# Altium schematic sheet ClockGenerator.SchDoc: Clock Generator
size A2; DrawnBy: Patrik Staudenmayer; DocumentNumber: 11; SheetNumber: 11; SheetTotal: 15
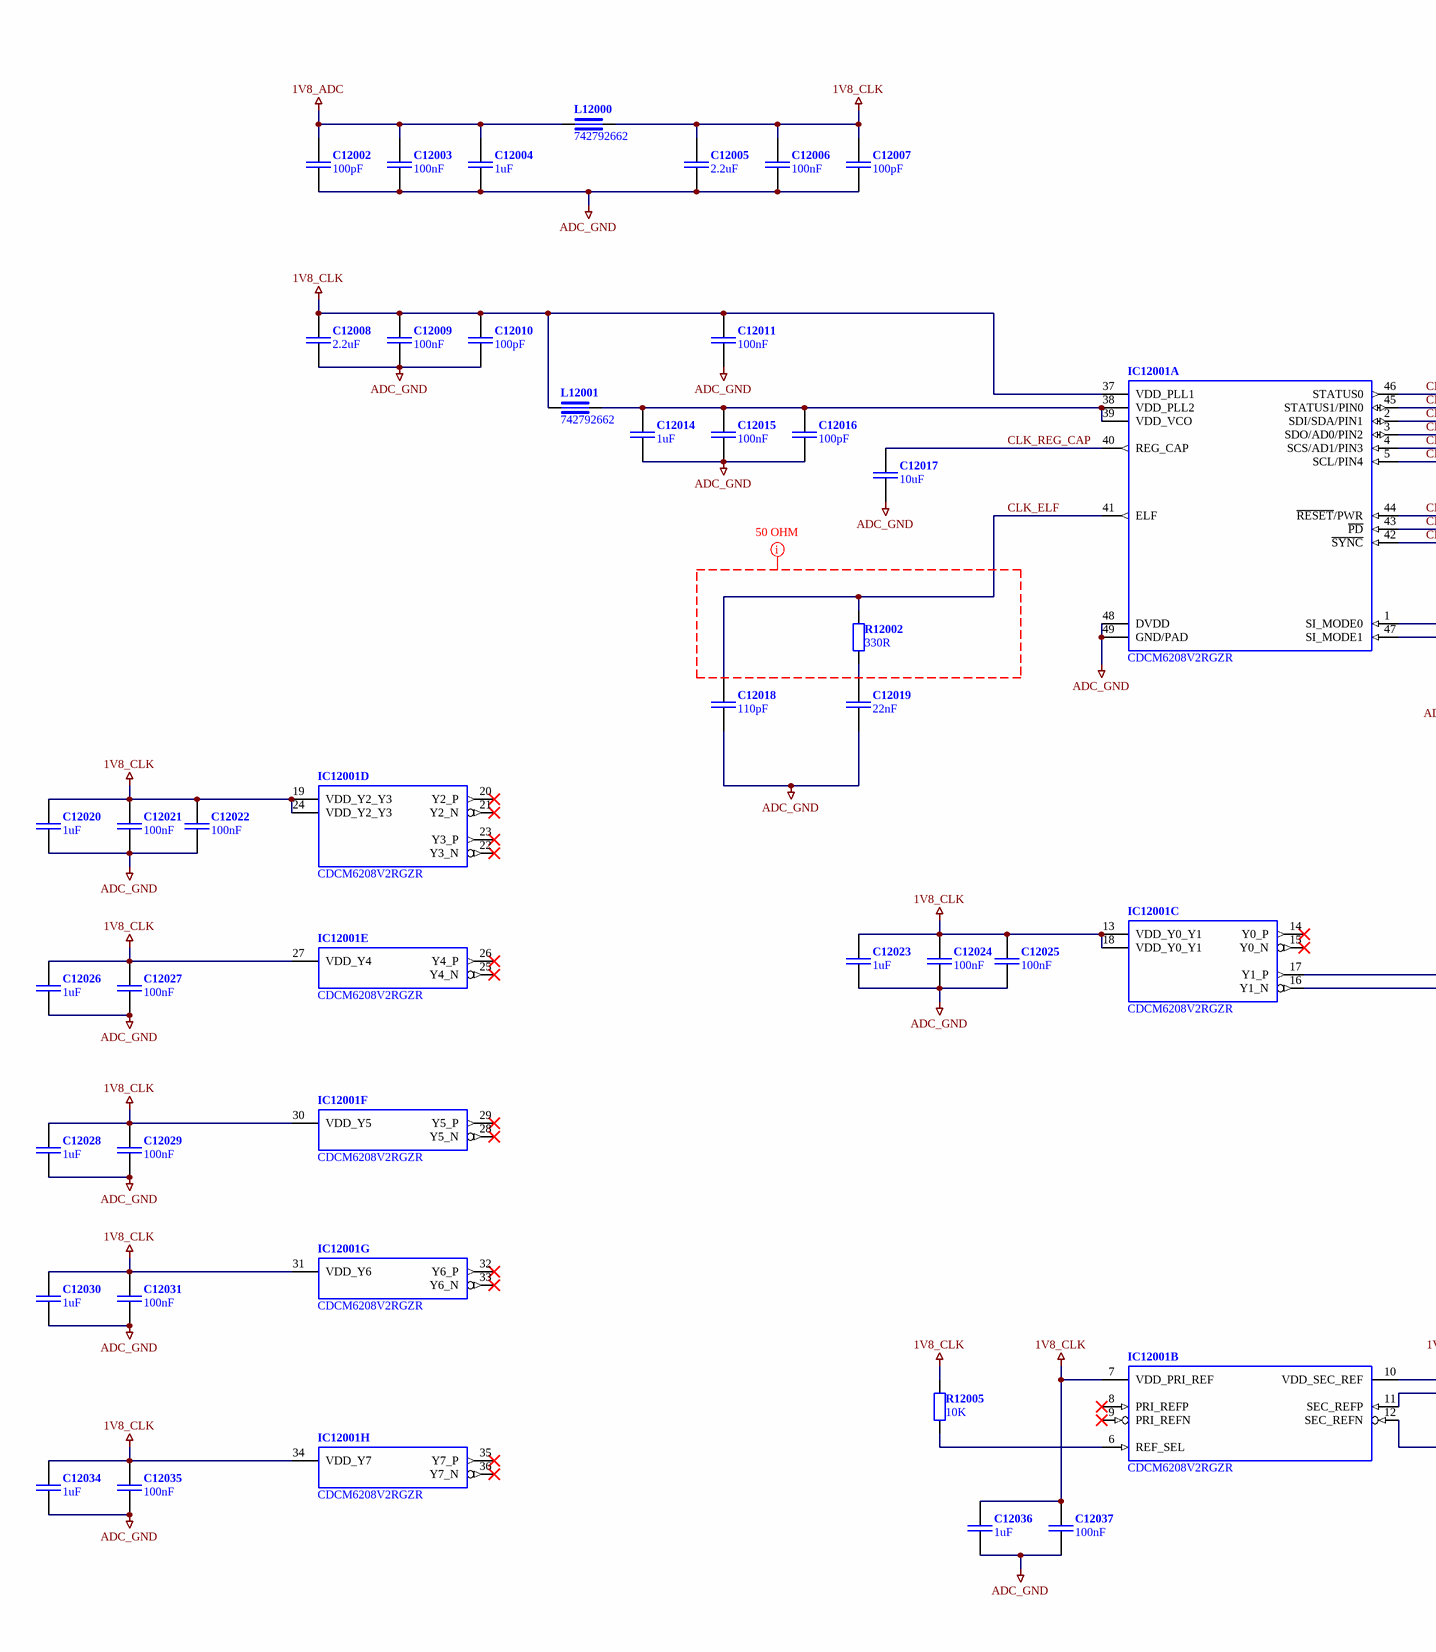
[diagram p0: ClockGenerator.SchDoc, left]
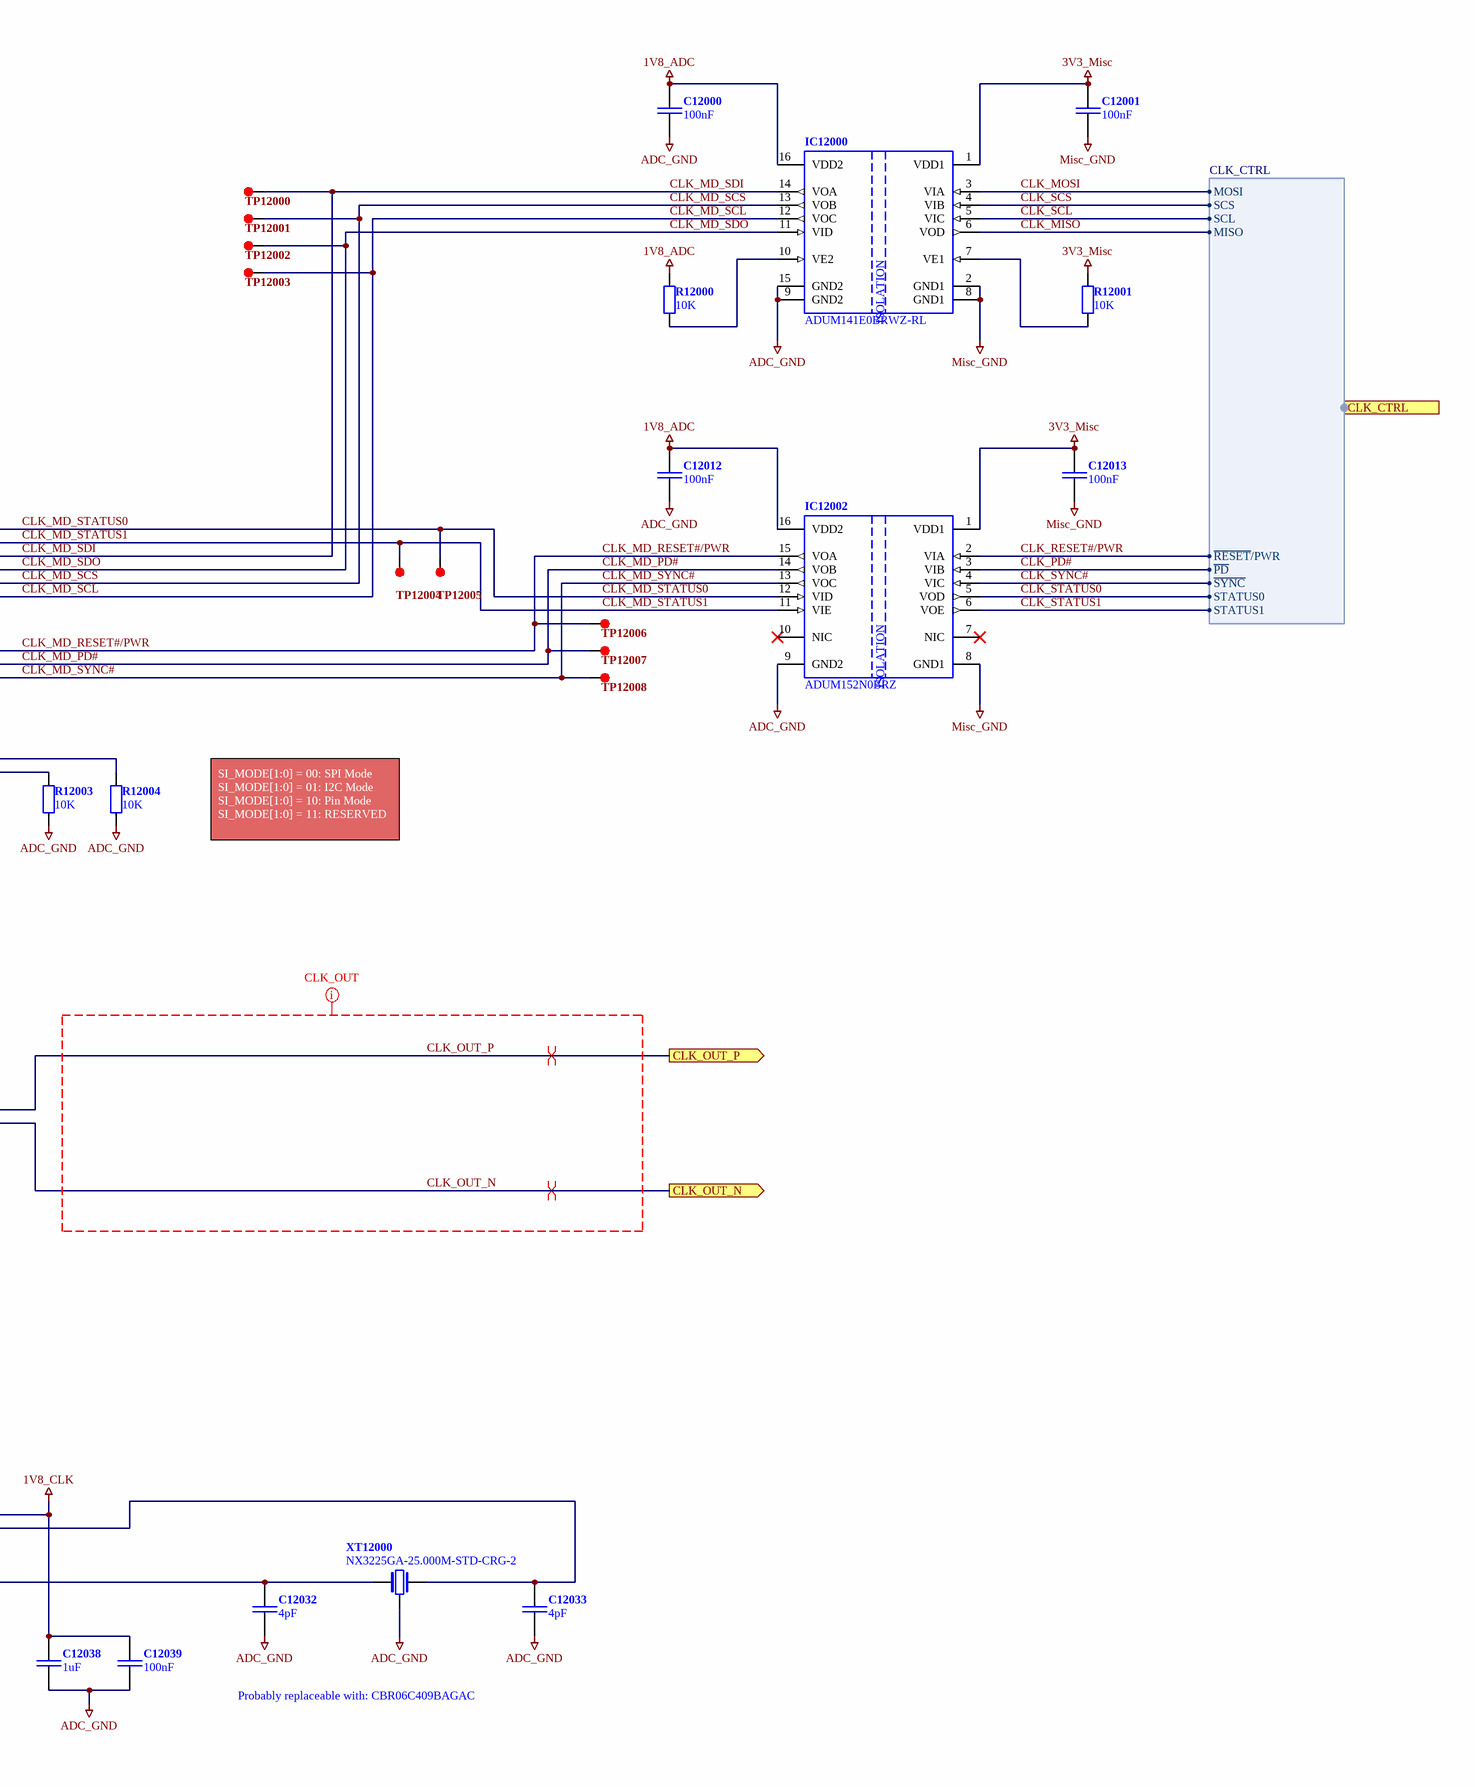
[diagram p1: ClockGenerator.SchDoc, right]

## Parts
C12000  100nF  [C_0603_N [CAPC1608N IPC]]
C12001  100nF  [C_0603_N [CAPC1608N IPC]]
C12002  100pF  [C_0402_N [CAPC1005N IPC]]
C12003  100nF  [C_0603_N [CAPC1608N IPC]]
C12004  1uF  [C_0805_N [CAPC2013N IPC]]
C12005  2.2uF  [C_0805_N [CAPC2013N IPC]]
C12006  100nF  [C_0603_N [CAPC1608N IPC]]
C12007  100pF  [C_0402_N [CAPC1005N IPC]]
C12008  2.2uF  [C_0805_N [CAPC2013N IPC]]
C12009  100nF  [C_0603_N [CAPC1608N IPC]]
C12010  100pF  [C_0402_N [CAPC1005N IPC]]
C12011  100nF  [C_0603_N [CAPC1608N IPC]]
C12012  100nF  [C_0603_N [CAPC1608N IPC]]
C12013  100nF  [C_0603_N [CAPC1608N IPC]]
C12014  1uF  [C_0805_N [CAPC2013N IPC]]
C12015  100nF  [C_0603_N [CAPC1608N IPC]]
C12016  100pF  [C_0402_N [CAPC1005N IPC]]
C12017  10uF  [C_0805_N [CAPC2013N IPC]]
C12018  110pF  [C_0603_N [CAPC1608N IPC]]
C12019  22nF  [C_0603_N [CAPC1608N IPC]]
C12020  1uF  [C_0805_N [CAPC2013N IPC]]
C12021  100nF  [C_0603_N [CAPC1608N IPC]]
C12022  100nF  [C_0603_N [CAPC1608N IPC]]
C12023  1uF  [C_0805_N [CAPC2013N IPC]]
C12024  100nF  [C_0603_N [CAPC1608N IPC]]
C12025  100nF  [C_0603_N [CAPC1608N IPC]]
C12026  1uF  [C_0805_N [CAPC2013N IPC]]
C12027  100nF  [C_0603_N [CAPC1608N IPC]]
C12028  1uF  [C_0805_N [CAPC2013N IPC]]
C12029  100nF  [C_0603_N [CAPC1608N IPC]]
C12030  1uF  [C_0805_N [CAPC2013N IPC]]
C12031  100nF  [C_0603_N [CAPC1608N IPC]]
C12032  4pF  [C_0603_N [CAPC1608N IPC]]
C12033  4pF  [C_0603_N [CAPC1608N IPC]]
C12034  1uF  [C_0805_N [CAPC2013N IPC]]
C12035  100nF  [C_0603_N [CAPC1608N IPC]]
C12036  1uF  [C_0805_N [CAPC2013N IPC]]
C12037  100nF  [C_0603_N [CAPC1608N IPC]]
C12038  1uF  [C_0805_N [CAPC2013N IPC]]
C12039  100nF  [C_0603_N [CAPC1608N IPC]]
IC12000  ADUM141E0BRWZ-RL  [SOIC127P1030X265-16N IPC]
IC12001  CDCM6208V2RGZR  [QFN50P700X700X100_HS-49N IPC]  (parts A,B,C,D,E,F,G,H of 8)
IC12002  ADUM152N0BRZ  [SOIC127P600X175-16N IPC]
L12000  742792662  [L_0603_N [INDC1608N IPC]]
L12001  742792662  [L_0603_N [INDC1608N IPC]]
R12000  10K  [R_0603_N [RESC1608N IPC]]
R12001  10K  [R_0603_N [RESC1608N IPC]]
R12002  330R  [R_0603_N [RESC1608N IPC]]
R12003  10K  [R_0603_N [RESC1608N IPC]]
R12004  10K  [R_0603_N [RESC1608N IPC]]
R12005  10K  [R_0603_N [RESC1608N IPC]]
TP12000  TP_GENERIC  [TP_0.8_P100T]  (value not drawn)  (no BOM)
TP12001  TP_GENERIC  [TP_0.8_P100T]  (value not drawn)  (no BOM)
TP12002  TP_GENERIC  [TP_0.8_P100T]  (value not drawn)  (no BOM)
TP12003  TP_GENERIC  [TP_0.8_P100T]  (value not drawn)  (no BOM)
TP12004  TP_GENERIC  [TP_0.8_P100T]  (value not drawn)  (no BOM)
TP12005  TP_GENERIC  [TP_0.8_P100T]  (value not drawn)  (no BOM)
TP12006  TP_GENERIC  [TP_0.8_P100T]  (value not drawn)  (no BOM)
TP12007  TP_GENERIC  [TP_0.8_P100T]  (value not drawn)  (no BOM)
TP12008  TP_GENERIC  [TP_0.8_P100T]  (value not drawn)  (no BOM)
XT12000  NX3225GA-25.000M-STD-CRG-2  [XT_SMD_320x250_H100_4PIN]

## Ports
CLK_CTRL (harness CLK_CTRL), CLK_OUT_N (out), CLK_OUT_P (out)

## Harnesses
CLK_CTRL: MOSI, SCS, SCL, MISO, ~{RESET}/PWR, ~{PD}, ~{SYNC}, STATUS0, STATUS1

## Nets
1V8_ADC: C12000.1 C12002.1 C12003.1 C12004.1 C12012.1 IC12000.16(VDD2) IC12002.16(VDD2) L12000.2 R12000.2
1V8_CLK: C12005.1 C12006.1 C12007.1 C12008.1 C12009.1 C12010.1 C12011.1 C12020.1 C12021.1 C12022.1 C12023.1 C12024.1 C12025.1 C12026.1 C12027.1 C12028.1 C12029.1 C12030.1 C12031.1 C12034.1 C12035.1 C12036.1 C12037.1 C12038.1 C12039.1 IC12001.7(VDD_PRI_REF) IC12001.10(VDD_SEC_REF) IC12001.13(VDD_Y0_Y1) IC12001.18(VDD_Y0_Y1) IC12001.19(VDD_Y2_Y3) IC12001.24(VDD_Y2_Y3) IC12001.27(VDD_Y4) IC12001.30(VDD_Y5) IC12001.31(VDD_Y6) IC12001.34(VDD_Y7) IC12001.37(VDD_PLL1) L12000.1 L12001.2 R12005.2
3V3_Misc: C12001.1 C12013.1 IC12000.1(VDD1) IC12002.1(VDD1) R12001.2
ADC_GND: C12000.2 C12002.2 C12003.2 C12004.2 C12005.2 C12006.2 C12007.2 C12008.2 C12009.2 C12010.2 C12011.2 C12012.2 C12014.2 C12015.2 C12016.2 C12017.2 C12018.1 C12019.1 C12020.2 C12021.2 C12022.2 C12023.2 C12024.2 C12025.2 C12026.2 C12027.2 C12028.2 C12029.2 C12030.2 C12031.2 C12032.2 C12033.2 C12034.2 C12035.2 C12036.2 C12037.2 C12038.2 C12039.2 IC12000.9(GND2) IC12000.15(GND2) IC12001.48(DVDD) IC12001.49(GND/PAD) IC12002.9(GND2) R12003.1 R12004.1 XT12000.SH
Misc_GND: C12001.2 C12013.2 IC12000.2(GND1) IC12000.8(GND1) IC12002.8(GND1)
CLK_ELF: C12018.2 IC12001.41(ELF) R12002.2
CLK_MD_PD#: IC12001.43(~{PD}) IC12002.14(VOB) TP12007.1
CLK_MD_RESET#/PWR: IC12001.44(~{RESET}/PWR) IC12002.15(VOA) TP12006.1
CLK_MD_SCL: IC12000.12(VOC) IC12001.5(SCL/PIN4) TP12003.1
CLK_MD_SCS: IC12000.13(VOB) IC12001.4(SCS/AD1/PIN3) TP12001.1
CLK_MD_SDI: IC12000.14(VOA) IC12001.2(SDI/SDA/PIN1) TP12000.1
CLK_MD_SDO: IC12000.11(VID) IC12001.3(SDO/AD0/PIN2) TP12002.1
CLK_MD_STATUS0: IC12001.46(STATUS0) IC12002.12(VID) TP12005.1
CLK_MD_STATUS1: IC12001.45(STATUS1/PIN0) IC12002.11(VIE) TP12004.1
CLK_MD_SYNC#: IC12001.42(~{SYNC}) IC12002.13(VOC) TP12008.1
CLK_MISO: IC12000.6(VOD) ; port CLK_CTRL.MISO
CLK_MOSI: IC12000.3(VIA) ; port CLK_CTRL.MOSI
CLK_OUT_N: IC12001.16(Y1_N) ; port CLK_OUT_N
CLK_OUT_P: IC12001.17(Y1_P) ; port CLK_OUT_P
CLK_PD#: IC12002.3(VIB) ; port CLK_CTRL.~{PD}
CLK_REG_CAP: C12017.1 IC12001.40(REG_CAP)
CLK_RESET#/PWR: IC12002.2(VIA) ; port CLK_CTRL.~{RESET}/PWR
CLK_SCL: IC12000.5(VIC) ; port CLK_CTRL.SCL
CLK_SCS: IC12000.4(VIB) ; port CLK_CTRL.SCS
CLK_STATUS0: IC12002.5(VOD) ; port CLK_CTRL.STATUS0
CLK_STATUS1: IC12002.6(VOE) ; port CLK_CTRL.STATUS1
CLK_SYNC#: IC12002.4(VIC) ; port CLK_CTRL.~{SYNC}
NetC12014_1: C12014.1 C12015.1 C12016.1 IC12001.38(VDD_PLL2) IC12001.39(VDD_VCO) L12001.1
NetC12019_2: C12019.2 R12002.1
NetC12032_1: C12032.1 IC12001.12(SEC_REFN) XT12000.3
NetC12033_1: C12033.1 IC12001.11(SEC_REFP) XT12000.1
NetIC12000_7: IC12000.7(VE1) R12001.1
NetIC12000_10: IC12000.10(VE2) R12000.1
NetIC12001_1: IC12001.1(SI_MODE0) R12004.2
NetIC12001_6: IC12001.6(REF_SEL) R12005.1
NetIC12001_47: IC12001.47(SI_MODE1) R12003.2

Not connected (* = marked no-connect by the designer): IC12001 8(PRI_REFP)* 9(PRI_REFN)* 14(Y0_P)* 15(Y0_N)* 20(Y2_P)* 21(Y2_N)* 22(Y3_N)* 23(Y3_P)* 25(Y4_N)* 26(Y4_P)* 28(Y5_N)* 29(Y5_P)* 32(Y6_P)* 33(Y6_N)* 35(Y7_P)* 36(Y7_N)*; IC12002 7(NIC)* 10(NIC)*

## Layout directives
rule Width Constraint [Pref Impedance = 50.00ohms    Min Impedance = 50.00ohms    Max Impedance = 50.00ohms]; rule Maximum Via Count Constraint [Max Count = 0]: (no net found under the mark)
net class CLK_OUT; rule Differential Pairs Routing [Pref Gap = 5mil    Min Gap  = 5mil    Max Gap  = 5milPref Width = 4.138mil    Min Width  = 2.925mil    Max Width  = 4.138mil]; rule Maximum Via Count Constraint [Max Count = 2]; rule Matched Net Lengths [Tolerance = 25mil]: CLK_OUT_N, CLK_OUT_P
differential pair: CLK_OUT_N, CLK_OUT_P

## Notes on the sheet
- SI_MODE[1:0] = 00: SPI Mode
  SI_MODE[1:0] = 01: I2C Mode
  SI_MODE[1:0] = 10: Pin Mode
  SI_MODE[1:0] = 11: RESERVED
- Probably replaceable with: CBR06C409BAGAC
- Project:
- Title:
- Size:
- Date:
- File:
- A2
- Project ID:
- Time:
- Sheet
- Version:
- of
- Variant:
- (in symbol IC_ADUM141E0BRWZ-RL) ISOLATION
- (in symbol IC_ADUM152N0BRZ) ISOLATION

## Library data of the parts
C12000-C12016 C12020-C12031 C12034-C12039 = C_GENERIC: Prometheus_ID: *; Prometheus_Manufacturer: *
  C12000 C12001 C12003 C12006 C12009 C12011-C12013 C12015 C12021 C12022 C12024 C12025 C12027 C12029 C12031 C12035 C12037 C12039: Prometheus_ManPartNo: 100nF; Prometheus_Comment: 100nF; Prometheus_CurrentFootprint: C_0603_N [CAPC1608N IPC]
  C12002 C12007 C12010 C12016: Prometheus_ManPartNo: 100pF; Prometheus_Comment: 100pF; Prometheus_CurrentFootprint: C_0402_N [CAPC1005N IPC]
  C12004 C12014 C12020 C12023 C12026 C12028 C12030 C12034 C12036 C12038: Prometheus_ManPartNo: 1uF; Prometheus_Comment: 1uF; Prometheus_CurrentFootprint: C_0805_N [CAPC2013N IPC]
  C12005 C12008: Prometheus_ManPartNo: 2.2uF; Prometheus_Comment: 2.2uF; Prometheus_CurrentFootprint: C_0805_N [CAPC2013N IPC]
C12017 = C_GENERIC: Prometheus_ManPartNo: GRM188R60J106KE47D; Prometheus_Manufacturer: Murata Electronics; Prometheus_ID: *; Prometheus_Comment: 10uF; Prometheus_CurrentFootprint: C_0805_N [CAPC2013N IPC]
C12018 = C_GENERIC: Prometheus_Manufacturer: Yageo; Prometheus_ID: CC0603JRNPO9BN111; Prometheus_ManPartNo: 110pF; Prometheus_Comment: 110pF; Prometheus_CurrentFootprint: C_0603_N [CAPC1608N IPC]
C12019 = C_GENERIC: Prometheus_Manufacturer: Yageo; Prometheus_ID: CC0603KRX7R9BB223; Prometheus_ManPartNo: 22nF; Prometheus_Comment: 22nF; Prometheus_CurrentFootprint: C_0603_N [CAPC1608N IPC]
C12032 C12033 = C_GENERIC: +- 0.05 pF; Prometheus_ManPartNo: CBR06C409A1GAC; Prometheus_Manufacturer: KEMET; Prometheus_ID: *; Prometheus_Comment: 4pF; Prometheus_CurrentFootprint: C_0603_N [CAPC1608N IPC]
IC12000 = IC_ADUM141E0BRWZ-RL: 3/1 digital isolator / 1.8 V to 5 V Level translation; Prometheus_Manufacturer: Analog Devices; Prometheus_ManPartNo: ADUM141E0BRWZ-RL; Prometheus_Comment: ADUM141E0BRWZ-RL; Prometheus_CurrentFootprint: SOIC127P1030X265-16N IPC; DatasheetURL: https://www.analog.com/media/en/technical-documentation/data-sheets/ADuM140D_140E_141D_141E_142D_142E.pdf
IC12001 = IC_CDCM6208V2: 2:8 Clock Generator, Jitter Cleaner with fractional dividers; Prometheus_Manufacturer: Texas Instruments; Prometheus_ManPartNo: CDCM6208V2RGZR; Prometheus_Comment: CDCM6208V2RGZR; Prometheus_CurrentFootprint: QFN50P700X700X100_HS-49N IPC; DatasheetURL: https://www.ti.com/general/docs/suppproductinfo.tsp?distId=10&gotoUrl=http%3A%2F%2Fwww.ti.com%2Flit%2Fgpn%2Fcdcm6208
IC12002 = IC_ADUM152N0BRZ: 3/2 digital isolator / 1.8 V to 5 V Level translation; Prometheus_Manufacturer: Analog Devices; Prometheus_ManPartNo: ADUM152N0BRZ; Prometheus_Comment: ADUM152N0BRZ; Prometheus_CurrentFootprint: SOIC127P600X175-16N IPC; DatasheetURL: https://www.analog.com/media/en/technical-documentation/data-sheets/ADuM150N-151N-152N.pdf
L12000 L12001 = FB_GENERIC: Prometheus_Manufacturer: Wuerth Electronics; Prometheus_ID: *; Prometheus_ManPartNo: 742792662; Prometheus_Comment: 742792662; Prometheus_CurrentFootprint: L_0603_N [INDC1608N IPC]
R12000 R12001 R12003-R12005 = R_GENERIC_DIN: Prometheus_ID: *; Prometheus_ManPartNo: 10K; Prometheus_Manufacturer: *; Prometheus_Comment: 10K; Prometheus_CurrentFootprint: R_0603_N [RESC1608N IPC]
R12002 = R_GENERIC_DIN: Prometheus_ManPartNo: ERJ-3EKF3300V; Prometheus_Manufacturer: Panasonic Electronic Components; Prometheus_ID: *; Prometheus_Comment: 330R; Prometheus_CurrentFootprint: R_0603_N [RESC1608N IPC]
TP12000-TP12008 = TP_GENERIC: Needle Test Point; Prometheus_ID: *; Prometheus_ManPartNo: TP_GENERIC; Prometheus_Manufacturer: *; Prometheus_Comment: TP_GENERIC; Prometheus_CurrentFootprint: TP_0.8_P100T
XT12000 = XT_NX3225GA-25.000M-STD-CRG-2: 25 MHz / 8 pF; Prometheus_Manufacturer: NDK; Prometheus_ID: *; Prometheus_ManPartNo: NX3225GA-25.000M-STD-CRG-2; Prometheus_Comment: NX3225GA-25.000M-STD-CRG-2; Prometheus_CurrentFootprint: XT_SMD_320x250_H100_4PIN; DatasheetURL: https://www.ndk.com/images/products/catalog/c_NX3225GA-STD-CRG-2_e.pdf